# EasyEDA Pro project InForThermometer.eprj

# Schematic Schematic1
Create Date: 2022-08-26; Page Name: P1; Project Name: InForThermometer; Schematic Name: Schematic1; Update Date: 2022-08-30
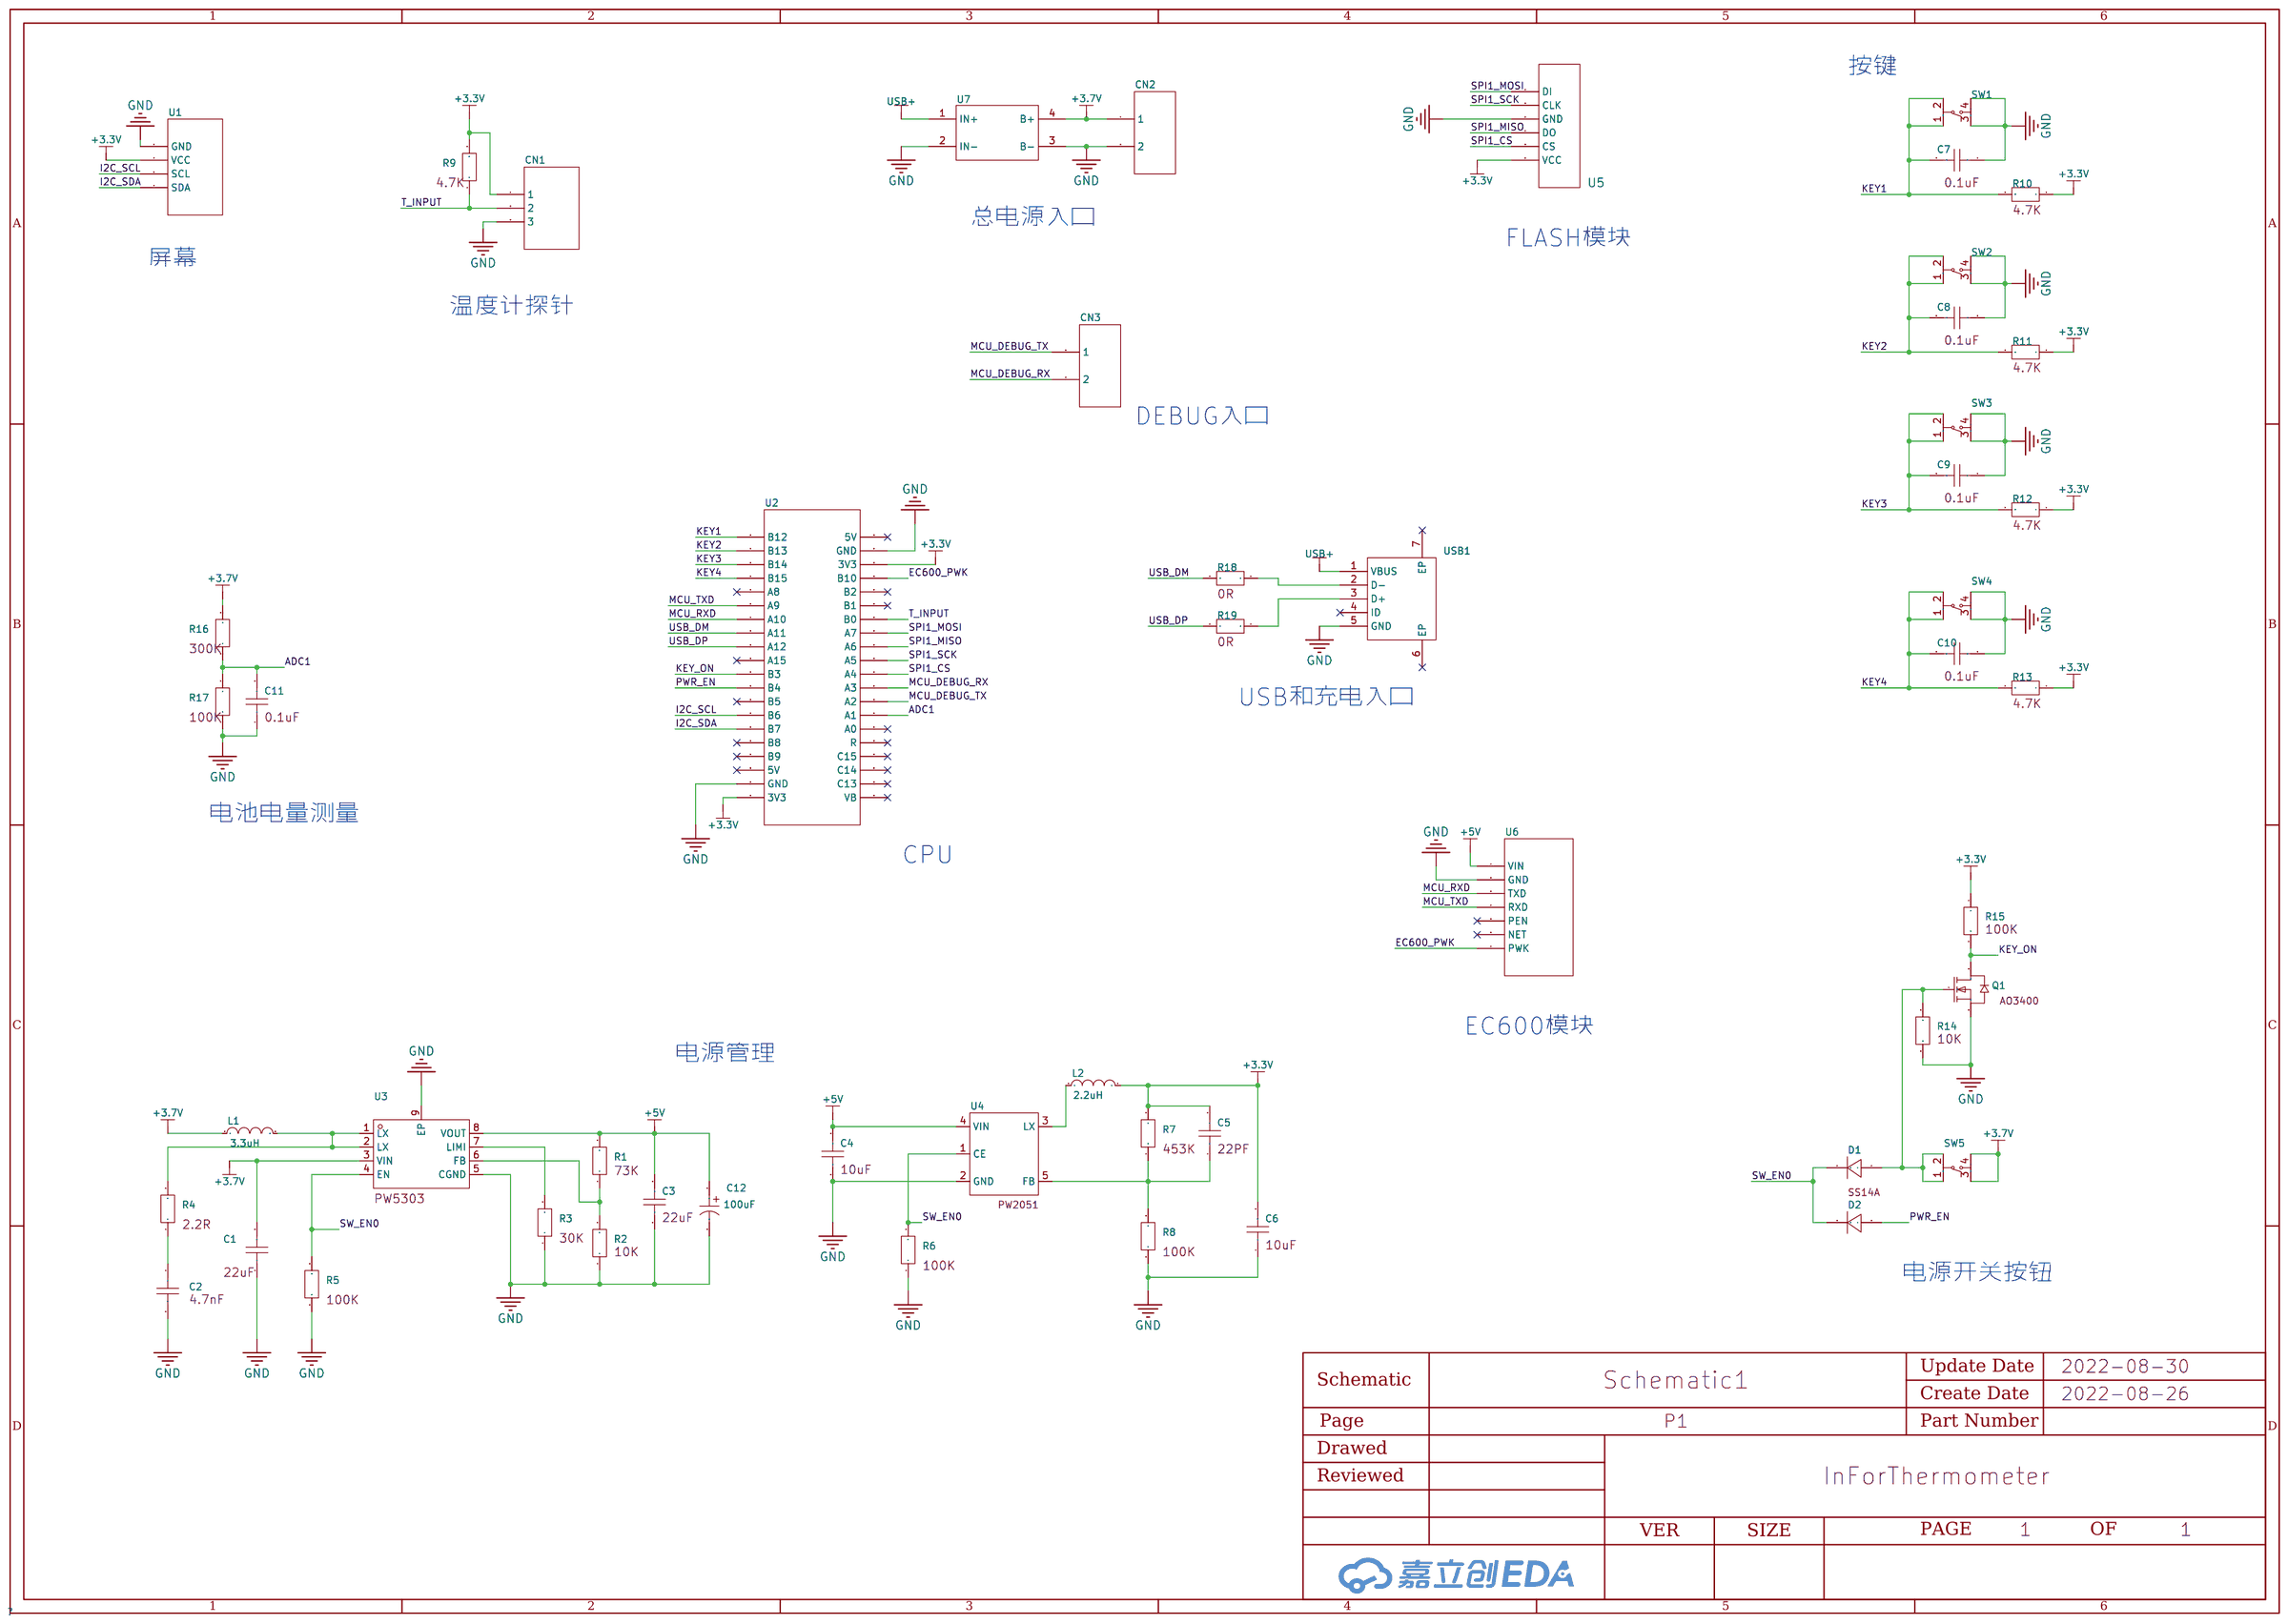
[diagram p0: schematic sheet]

## Parts
C1  -  [0603]
C2  -  [0603]
C3  -  [0603]
C4  -  [0603]
C5  -  [0603]
C6  -  [0603]
C7  -  [0603]
C8  -  [0603]
C9  -  [0603]
C10  -  [0603]
C11  -  [0603]
C12  100uF  [CAP-SMD_BD6.3-L6.6-W6.6-LS7.3-FD]
CN1  -  [XH2.54插件3P]
CN2  -  [XH2.54插件2P]
CN3  -  [XH2.54插件2P]
D1  -  [SMA_L4.3-W2.6-LS5.2-RD]
D2  -  [SMA_L4.3-W2.6-LS5.2-RD]
L1  3.3uH  [IND-SMD_L5.5-W5.0]
L2  2.2uH  [IND-SMD_L4.0-W4.0_0.47UH04209.5A]
Q1  -  [SOT-23-3_L2.9-W1.3-P1.90-LS2.4-BL-2]
R1  -  [0603]
R2  -  [0603]
R3  -  [0603]
R4  -  [0603]
R5  -  [0603]
R6  -  [0603]
R7  -  [0603]
R8  -  [0603]
R9  -  [0603]
R10  -  [0603]
R11  -  [0603]
R12  -  [0603]
R13  -  [0603]
R14  -  [0603]
R15  -  [0603]
R16  -  [0603]
R17  -  [0603]
R18  -  [0603]
R19  -  [0603]
SW1  -  [按钮开关]
SW2  -  [按钮开关]
SW3  -  [按钮开关]
SW4  -  [按钮开关]
SW5  -  [按钮开关]
U1  -  [方形OLED屏幕]
U2  -  [stm32f411模块]
U3  PW5303  [SOP-8_L4.9-W3.9-P1.27-LS6.0-BL-EP-2]
U4  -  [SOT-23-5_L2.9-W1.6-P0.95-LS2.8-BR]
U5  -  [W25Q128FLASH模块]
U6  -  [EC600模块]
U7  -  [TP4056M]
USB1  U-D-M5DD-W-1  [MICRO-USB-TH_MICRO-USB-A14]

## Library data of the parts
C1 C3 = 0603电容: Capacitance: 22uF
C2 = 0603电容: Capacitance: 4.7nF
C4 C6 = 0603电容: Capacitance: 10uF
C5 = 0603电容: Capacitance: 22PF
C7-C11 = 0603电容: Capacitance: 0.1uF
C12 = XT100UF25V90RV0062: 容值:100uF;额定电压:25V;电容体直径:-;电容体长度:-;纹波电流:-;等效串联电阻:-;工作寿命:-;; LCSC Part Name: 100uF 25V; Supplier Part: C2992594; Manufacturer: KNSCHA(科尼盛); Supplier Footprint: SMD,6.3x7.7mm; JLCPCB Part Class: Extended Part; Datasheet: https://atta.szlcsc.com/upload/public/pdf/source/20220414/767750125710ECCCAB7D9F77FC781825.pdf; Supplier: LCSC; Rated Voltage: 25V
CN1 = XH2.54插件3P
CN2 CN3 = XH2.54插件2P
D1 D2 = SS14A: 直流反向耐压(Vr):40V;平均整流电流(Io):1A;正向压降(Vf):500mV@1A;; Supplier: LCSC; Supplier Part: C211770; Supplier Footprint: SMA(DO-214AC); JLCPCB Part Class: Extended Part; LCSC Part Name: 40V 1A 500mV@1A; Datasheet: https://atta.szlcsc.com/upload/public/pdf/source/20180504/C211770_627C435F34E9C107E4A4301F69D28675.pdf; Manufacturer: YANGJIE(扬杰); Average Rectified Current (Io): 1A; Forward Voltage (Vf@If): 500mV@1A; Reverse Voltage (Vr): 40V
L1 = YXMAC0502-3R3M-ANF: 电感值:3.3uH;精度:±20%;额定电流:3A;直流电阻(DCR):76mΩ;; LCSC Part Name: 3.3uH ±20% 3A 76mΩ; Supplier Part: C241344; Manufacturer: 宇鑫科技; Supplier Footprint: SMD; JLCPCB Part Class: Extended Part; Datasheet: https://atta.szlcsc.com/upload/public/pdf/source/20180927/C241344_8E8F720DAEB332122927E4BC9F5CDD37.pdf; Supplier: LCSC; Tolerance: ±20%; Rated Current: 3A; DC Resistance (DCR): 76mΩ
L2 = CMLO0420H2R2MTT: 电感值:2.2uH;精度:±20%;额定电流:3A;直流电阻(DCR):-;; LCSC Part Name: 2.2uH ±20% 3A; Supplier Part: C438930; Manufacturer: Cybermax(思博科技); Supplier Footprint: SMD; JLCPCB Part Class: Extended Part; Supplier: LCSC; Tolerance: ±20%; Rated Current: 3A
Q1 = AO3400: Supplier: LCSC; Supplier Part: C9900013365; Supplier Footprint: SOT23; JLCPCB Part Class: Extended Part; Datasheet: https://atta.szlcsc.comnull
R1 = 电阻: 0603 标准贴片电阻; Resistance: 73K
R2 R14 = 电阻: 0603 标准贴片电阻; Resistance: 10K
R3 = 电阻: 0603 标准贴片电阻; Resistance: 30K
R4 = 电阻: 0603 标准贴片电阻; Resistance: 2.2R
R5 R6 R8 R15 R17 = 电阻: 0603 标准贴片电阻; Resistance: 100K
R7 = 电阻: 0603 标准贴片电阻; Resistance: 453K
R9-R13 = 电阻: 0603 标准贴片电阻; Resistance: 4.7K
R16 = 电阻: 0603 标准贴片电阻; Resistance: 300K
R18 R19 = 电阻: 0603 标准贴片电阻; Resistance: 0R
SW1-SW5 = 按键开关
U1 = 方形OLED屏幕
U2 = stm32f411模块
U3 = PW5303: Supplier Part: C9900000816; Supplier Footprint: ESOP-8EP(4.9x3.9x1.27); JLCPCB Part Class: Extended Part; Datasheet: 2021-10-11/146951A/7b65bb5b4c494c348ec27871fef777b5/PW5303.pdf; Supplier: LCSC
U4 = PW2051: Supplier: LCSC; Supplier Part: C9900004763; Supplier Footprint: SOT23-5; JLCPCB Part Class: Extended Part; Datasheet: 2021-12-24/856123Z/fbe1facec1e64a42b88c21fe7c936e8d/PW2051.pdf
U5 = W25Q128FLASH模块
U6 = EC600模块
U7 = TP4056M
USB1 = U-D-M5DD-W-1: 连接器类型:Micro-B;标准:USB 2.0;公母:母座;触点数量:5;端口数量:1;; LCSC Part Name: Micro-B 母座; Supplier Part: C145795; Manufacturer: 韩国韩荣; Supplier Footprint: 插件; JLCPCB Part Class: Extended Part; Datasheet: https://atta.szlcsc.com/upload/public/pdf/source/20190321/C145795_7870B82BC79666CAD2740B4BEFFA2B3B.pdf; Supplier: LCSC; Connector Type: Micro-B; Standard: USB 2.0; Gender: 母座; Number of Contacts: 5; Number of Ports: 1

## Nets
+3.3V: C5.2 C6.2 CN1.1 L2.2 R7.2 R9.2 R10.1 R11.1 R12.1 R13.1 R15.1 U1.2(VCC) U2.20(3V3) U2.23(3V3) U5.6(VCC)
+3.7V: C1.2 CN2.1 L1.1 R16.2 SW5.3(C) SW5.4(D) U3.3(VIN) U7.4(B+)
+5V: C3.2 C4.2 C12.1 R1.2 U3.8(VOUT) U4.4(VIN) U6.7(VIN)
GND: C1.1 C2.2 C3.1 C4.1 C6.1 C7.1 C8.1 C9.1 C10.1 C11.1 C12.2 CN1.3 CN2.2 Q1.2(S) R2.1 R3.1 R5.1 R6.1 R8.1 R14.2 R17.1 SW1.3(C) SW1.4(D) SW2.3(C) SW2.4(D) SW3.3(C) SW3.4(D) SW4.3(C) SW4.4(D) U1.1(GND) U2.19(GND) U2.22(GND) U3.5(CGND) U3.9(EP) U4.2(GND) U5.3(GND) U6.6(GND) U7.2(IN-) U7.3(B-) USB1.5(GND)
ADC1: C11.2 R16.1 R17.2 U2.34(A1)
EC600_PWK: U2.24(B10) U6.1(PWK)
I2C_SCL: U1.3(SCL) U2.14(B6)
I2C_SDA: U1.4(SDA) U2.15(B7)
KEY1: C7.2 R10.2 SW1.1(A) SW1.2(B) U2.1(B12)
KEY2: C8.2 R11.2 SW2.1(A) SW2.2(B) U2.2(B13)
KEY3: C9.2 R12.2 SW3.1(A) SW3.2(B) U2.3(B14)
KEY4: C10.2 R13.2 SW4.1(A) SW4.2(B) U2.4(B15)
KEY_ON: Q1.3(D) R15.2 U2.11(B3)
MCU_DEBUG_RX: CN3.2 U2.32(A3)
MCU_DEBUG_TX: CN3.1 U2.33(A2)
MCU_RXD: U2.7(A10) U6.5(TXD)
MCU_TXD: U2.6(A9) U6.4(RXD)
PWR_EN: D2.2(A) U2.12(B4)
SPI1_CS: U2.31(A4) U5.5(CS)
SPI1_MISO: U2.29(A6) U5.4(DO)
SPI1_MOSI: U2.28(A7) U5.1(DI)
SPI1_SCK: U2.30(A5) U5.2(CLK)
SW_EN0: D1.1(C) D2.1(C) R5.2 R6.2 U3.4(EN) U4.1(CE)
T_INPUT: CN1.2 R9.1 U2.27(B0)
USB+: U7.1(IN+) USB1.1(VBUS)
USB_DM: R18.2 U2.8(A11)
USB_DP: R19.2 U2.9(A12)
$1N2071: R1.1 R2.2 U3.6(FB)
$1N2222: R3.2 U3.7(LIMI)
$1N2878: L1.2 R4.2 U3.1(LX) U3.2(LX)
$1N3070: C2.1 R4.1
$1N4682: L2.1 U4.3(LX)
$1N4812: C5.1 R7.1 R8.2 U4.5(FB)
$1N14702: D1.2(A) Q1.1(G) R14.1 SW5.1(A) SW5.2(B)
$1N32797: R18.1 USB1.2(D-)
$1N32852: R19.1 USB1.3(D+)

Not connected (* = marked no-connect by the designer): U2 5(A8)* 10(A15)* 13(B5)* 16(B8)* 17(B9)* 18(5V)* 21(5V)* 25(B2)* 26(B1)* 35(A0)* 36(R)* 37(C15)* 38(C14)* 39(C13)* 40(VB)*; U6 2(NET)* 3(PEN)*; USB1 4(ID)* 6(EP)* 7(EP)*

## Notes on the sheet
- 按键
- 总电源入口
- FLASH模块
- 屏幕
- 温度计探针
- DEBUG入口
- USB和充电入口
- 电池电量测量
- CPU
- EC600模块
- 电源管理
- 电源开关按钮

# Board PCB1
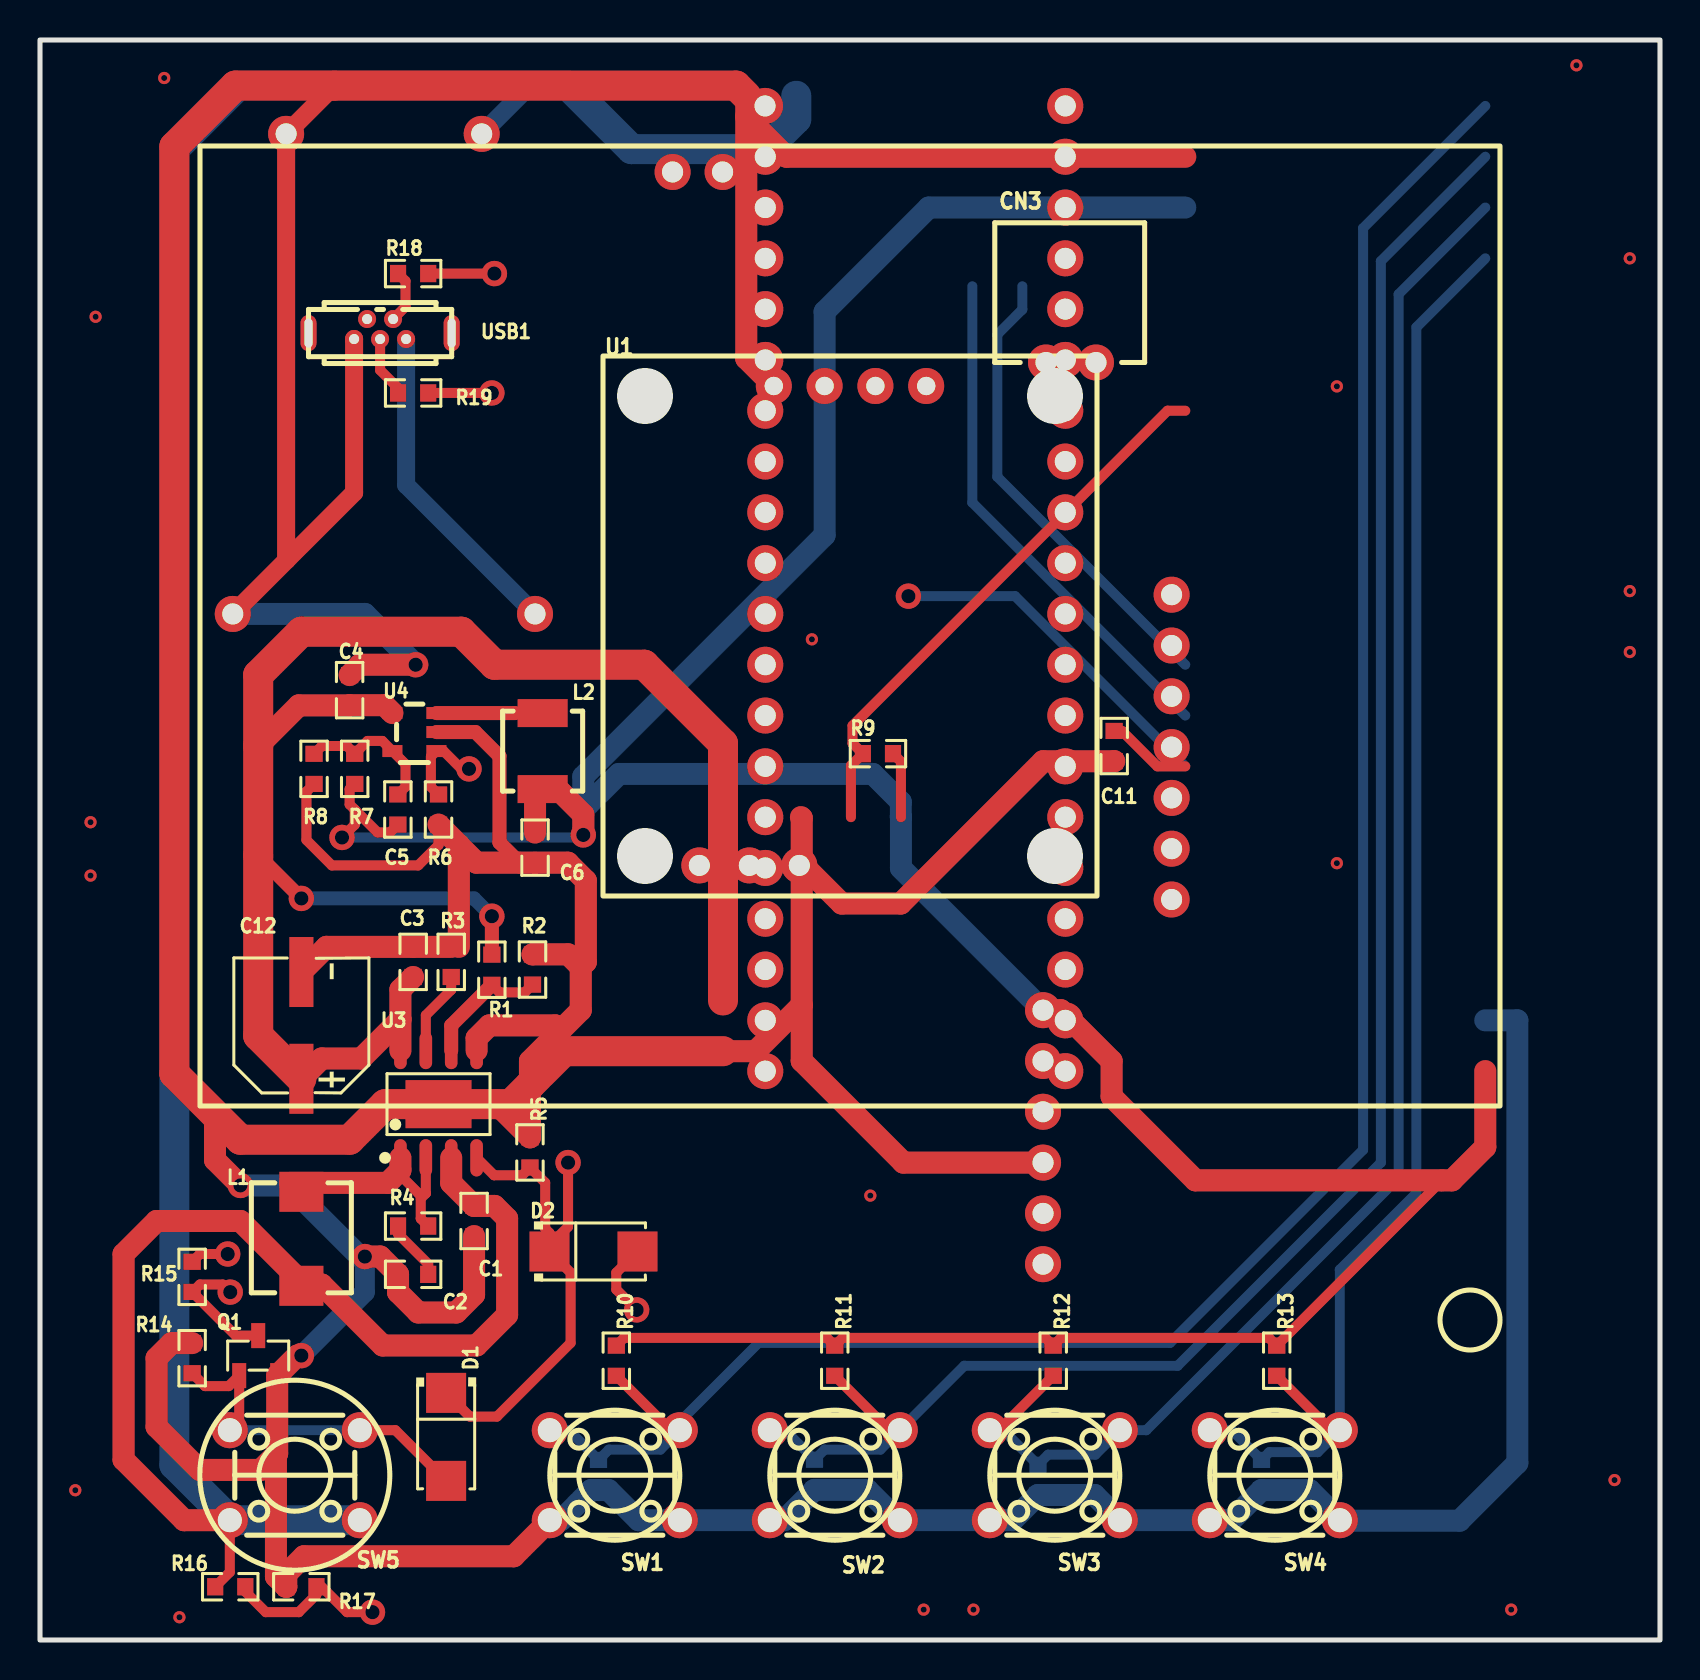
[diagram p1: board, top side]
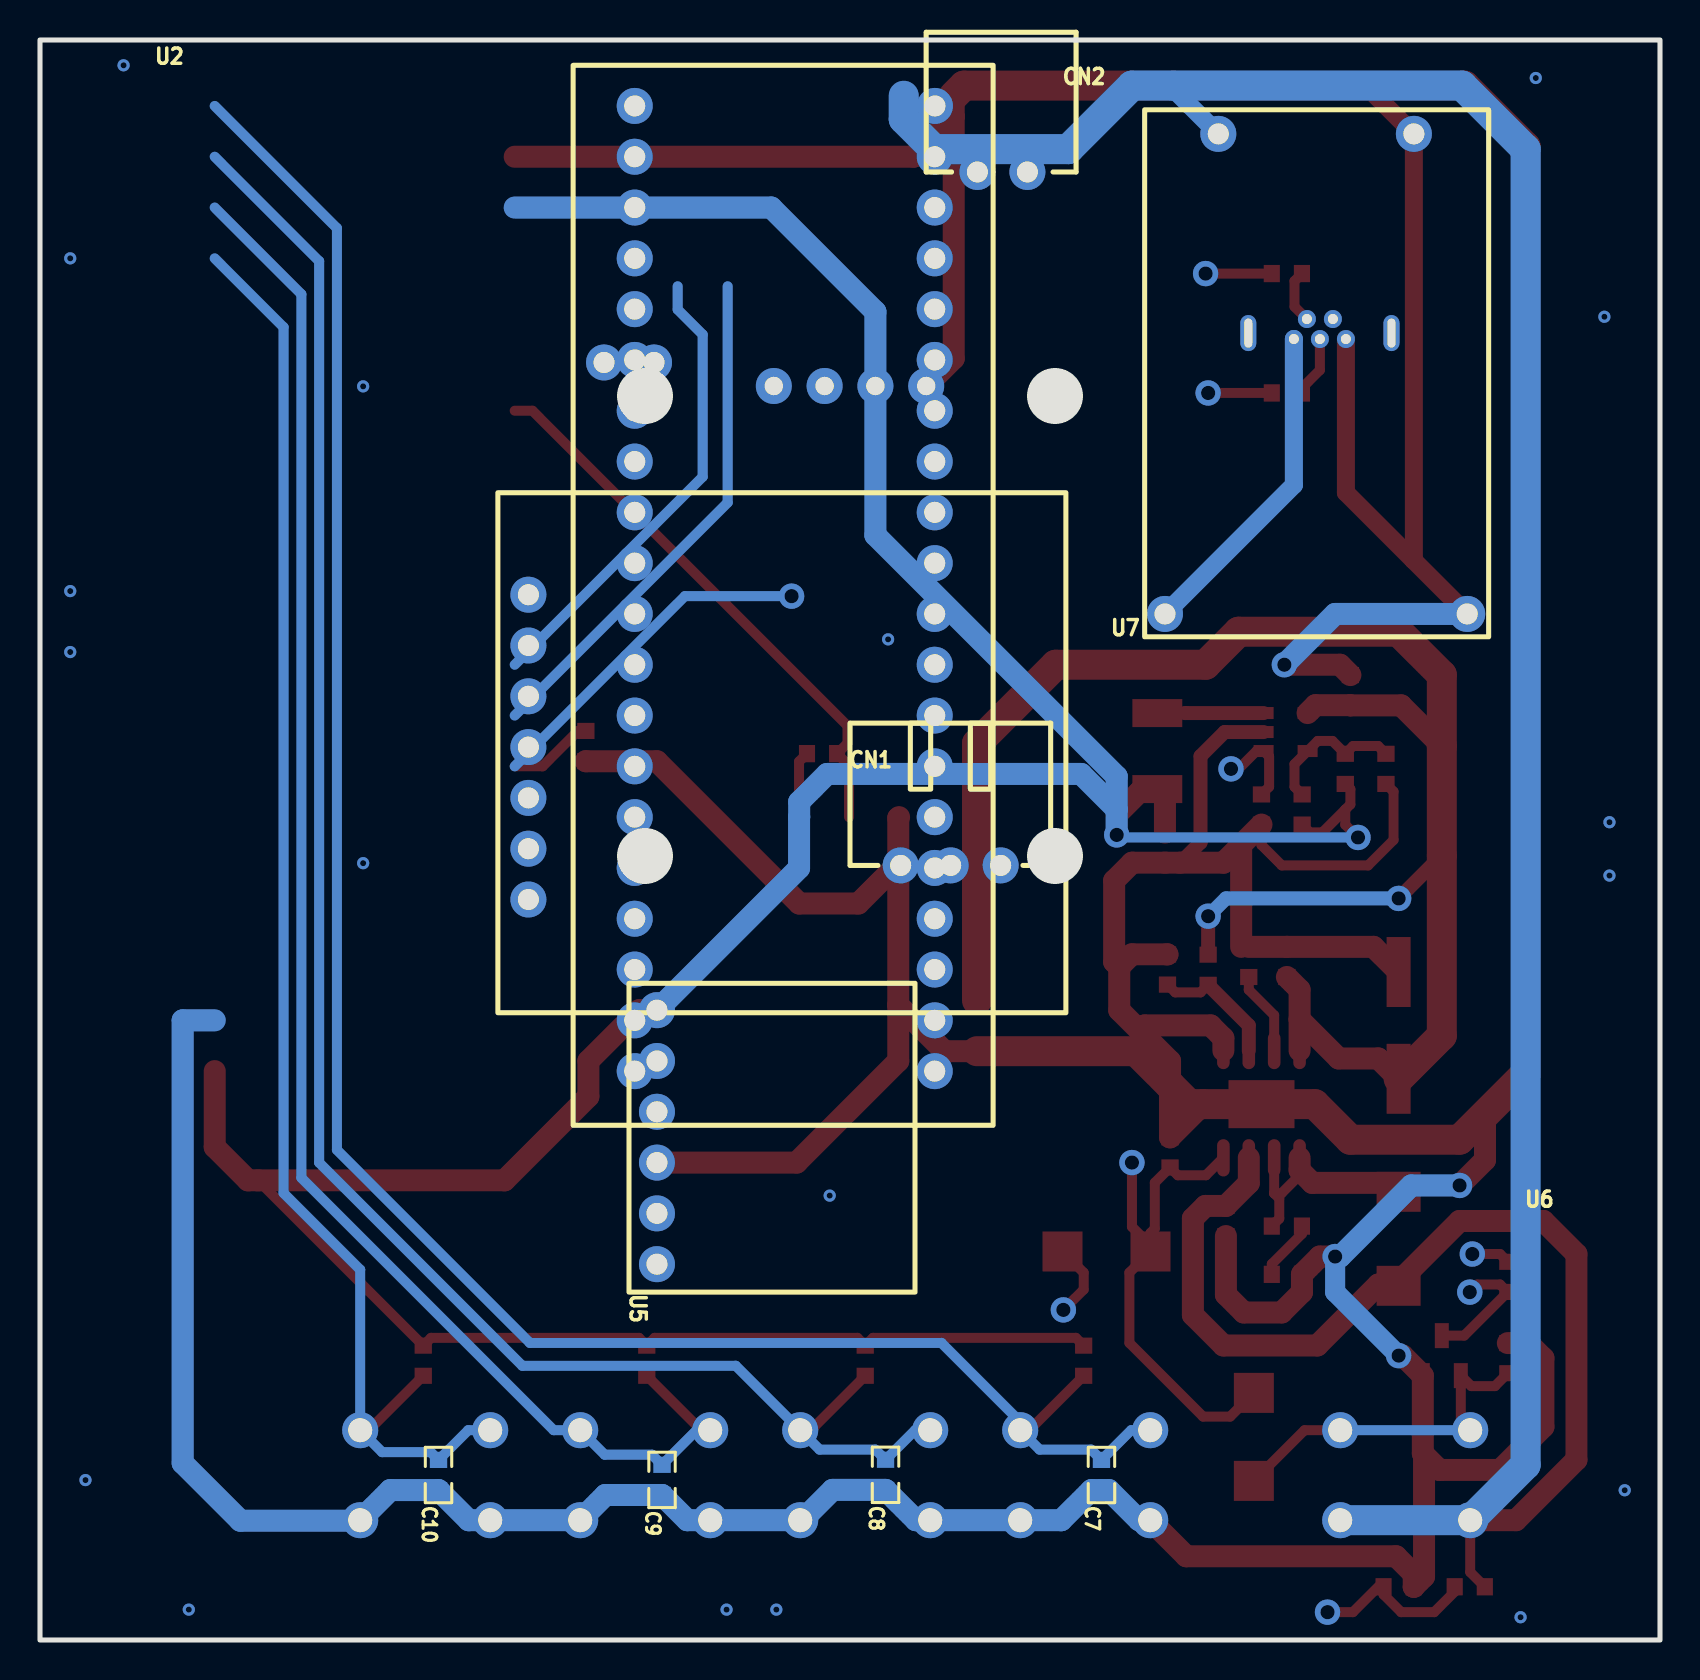
[diagram p2: board, bottom side, seen from below]

Outline 81 x 80 mm; copper layers: Top Layer, CPU1, CPU2, Bottom Layer. Coordinates in mm from the lower left corner of the outline.
Outline path: rectangle 0,80 81,0
Stack: Top Layer 0.035mm / Dielectric1 0.48mm PP er 4.5 / CPU1 0.035mm / Dielectric2 0.48mm FR4 er 4.5 / CPU2 0.035mm / Dielectric3 0.48mm PP er 4.5 / Bottom Layer 0.035mm

## Design rules (mm)
spacing safeClearance (default): track to track 0.152, other pairs 0.152 to 0.3
track width trackWidth (default): min 0.127, default 0.254, max 2.54
differential pair differentialPair (default): width min 0.127, default 0.254, max 2.54; gap min 0.152, default 0.152
via viaSize (default): diameter min 0.5, default 0.61, max 10; hole min 0.3, default 0.305, max 6

## Placement (name value [footprint] x y rotation side)
C1  -  [0603]  21.7 20.95 90 top
C2  -  [0603]  18.66 18.28 180 top
C3  -  [0603]  18.66 33.9 270 top
C4  -  [0603]  15.48 47.49 270 top
C5  -  [0603]  17.89 41.52 270 top
C6  -  [0603]  24.75 39.62 90 top
C7  -  [0603]  27.93 8.25 90 bottom
C8  -  [0603]  38.72 8.26 90 bottom
C9  -  [0603]  49.9 8 90 bottom
C10  -  [0603]  61.07 8.25 90 bottom
C11  -  [0603]  53.71 44.7 90 top
C12  100uF  [CAP-SMD_BD6.3-L6.6-W6.6-LS7.3-FD]  13.07 30.73 90 top
CN1  -  [XH2.54插件3P]  35.55 41.14 0 bottom
CN2  -  [XH2.54插件2P]  32.88 77.21 0 bottom
CN3  -  [XH2.54插件2P]  51.55 67.69 180 top
D1  -  [SMA_L4.3-W2.6-LS5.2-RD]  20.31 10.16 270 top
D2  -  [SMA_L4.3-W2.6-LS5.2-RD]  27.67 19.43 0 top
L1  3.3uH  [IND-SMD_L5.5-W5.0]  13.07 20.06 90 top
L2  2.2uH  [IND-SMD_L4.0-W4.0_0.47UH04209.5A]  25.13 44.44 270 top
Q1  -  [SOT-23-3_L2.9-W1.3-P1.90-LS2.4-BL-2]  10.91 14.22 0 top
R1  -  [0603]  22.59 33.51 90 top
R2  -  [0603]  24.62 33.52 270 top
R3  -  [0603]  20.56 33.9 270 top
R4  -  [0603]  18.66 20.7 0 top
R5  -  [0603]  24.5 24.38 270 top
R6  -  [0603]  19.93 41.52 90 top
R7  -  [0603]  15.73 43.56 270 top
R8  -  [0603]  13.7 43.56 90 top
R9  -  [0603]  41.9 44.32 0 top
R10  -  [0603]  28.82 13.97 270 top
R11  -  [0603]  39.74 13.97 270 top
R12  -  [0603]  50.66 13.97 270 top
R13  -  [0603]  61.84 13.97 270 top
R14  -  [0603]  7.61 14.09 90 top
R15  -  [0603]  7.61 18.16 270 top
R16  -  [0603]  9.51 2.66 180 top
R17  -  [0603]  13.07 2.66 0 top
R18  -  [0603]  18.66 68.32 0 top
R19  -  [0603]  18.66 62.35 0 top
SW1  -  [按钮开关]  28.74 8.24 0 top
SW2  -  [按钮开关]  39.74 8.24 0 top
SW3  -  [按钮开关]  50.74 8.24 0 top
SW4  -  [按钮开关]  61.74 8.24 0 top
SW5  -  [按钮开关]  12.74 8.24 0 top
U1  -  [方形OLED屏幕]  28.15 64.2 0 top
U2  -  [stm32f411模块]  54.34 78.73 180 bottom
U3  PW5303  [SOP-8_L4.9-W3.9-P1.27-LS6.0-BL-EP-2]  19.93 26.79 0 top
U4  -  [SOT-23-5_L2.9-W1.6-P0.95-LS2.8-BR]  18.72 45.4 0 top
U5  -  [W25Q128FLASH模块]  51.55 17.39 90 bottom
U6  -  [EC600模块]  35.67 37.08 90 bottom
U7  -  [TP4056M]  25.77 50.16 90 bottom
USB1  U-D-M5DD-W-1  [MICRO-USB-TH_MICRO-USB-A14]  17 65.55 180 top

## Footprints (pads in the part's own frame, mm; a bottom-side part is the same pattern mirrored in y, then rotated)
0603
  rect 0.806x0.864 smd: 1(-0.753,0) 2(0.753,0)
CAP-SMD_BD6.3-L6.6-W6.6-LS7.3-FD
  rect 3.5x1.2 smd: 1(-2.67,0) 2(2.67,0)
EC600模块
  round 1.8 hole 1.05: 1(-0.054,20.907) 2(2.486,20.907) 3(5.026,20.907) 4(7.566,20.907) 5(10.106,20.907) 6(12.646,20.907) 7(15.186,20.907)
IND-SMD_L4.0-W4.0_0.47UH04209.5A
  rect 1.399x2.499 smd: 1(-1.9,0) 2(1.9,0)
IND-SMD_L5.5-W5.0
  rect 1.999x2.2 smd: 1(-2.349,0) 2(2.349,0)
MICRO-USB-TH_MICRO-USB-A14
  round 0.899 hole 0.5: 1(-1.3,0.5) 2(-0.65,-0.5) 3(0,0.5) 4(0.65,-0.5) 5(1.3,0.5)
  oval 0.8x1.801 hole 0.399x1.45: 6(-3.579,0.201) 7(3.579,0.201)
SMA_L4.3-W2.6-LS5.2-RD
  rect 2x2 smd: 1(-2.2,0) 2(2.2,0)
SOP-8_L4.9-W3.9-P1.27-LS6.0-BL-EP-2
  oval 0.63x1.865 smd: 1(-1.905,-2.683) 2(-0.635,-2.683) 3(0.635,-2.683) 4(1.905,-2.683) 5(1.905,2.683) 6(0.635,2.683) 7(-0.635,2.683) 8(-1.905,2.683)
  rect 3.3x2.4 smd: 9(0,0)
SOT-23-3_L2.9-W1.3-P1.90-LS2.4-BL-2
  rect 0.7x1.25 smd: 1(-0.95,-1) 2(0.95,-1) 3(0,1)
SOT-23-5_L2.9-W1.6-P0.95-LS2.8-BR
  rect 1.001x0.6 smd: 1(1.1,-0.95) 2(1.1,0) 3(1.1,0.95) 4(-1.1,0.95) 5(-1.1,-0.95)
stm32f411模块
  round 1.8 hole 1.05: 1(3.079,-2.032) 2(3.079,-4.572) 3(3.079,-7.112) 4(3.079,-9.652) 5(3.079,-12.192) 6(3.079,-14.732) 7(3.079,-17.272) 8(3.079,-19.812) 9(3.079,-22.352) 10(3.079,-24.892) 11(3.079,-27.432) 12(3.079,-29.972) 13(3.079,-32.512) 14(3.079,-35.052) 15(3.079,-37.592) 16(3.079,-40.132) 17(3.079,-42.672) 18(3.079,-45.212) 19(3.079,-47.752) 20(3.079,-50.292) 21(18.09,-2.032) 22(18.079,-4.572) 23(18.079,-7.112) 24(18.079,-9.652) 25(18.079,-12.192) 26(18.079,-14.732) 27(18.079,-17.272) 28(18.079,-19.812) 29(18.079,-22.352) 30(18.079,-24.892) 31(18.079,-27.432) 32(18.079,-29.972) 33(18.079,-32.512) 34(18.079,-35.052) 35(18.079,-37.592) 36(18.079,-40.132) 37(18.079,-42.672) 38(18.079,-45.212) 39(18.079,-47.752) 40(18.079,-50.292)
TP4056M
  round 1.8 hole 1.05: 1(1.143,-1.016) 2(1.143,-16.129) 3(25.146,-13.462) 4(25.146,-3.683)
W25Q128FLASH模块
  round 1.8 hole 1.05: 1(1.397,-1.397) 2(3.937,-1.397) 3(6.477,-1.397) 4(9.017,-1.397) 5(11.557,-1.397) 6(14.097,-1.397)
XH2.54插件2P
  round 1.8 hole 1.05: 1(1.25,3.81) 2(-1.25,3.81)
XH2.54插件3P
  round 1.8 hole 1.05: 1(2.42,2.413) 2(-0.08,2.413) 3(-2.58,2.413)
按钮开关
  round 1.8 hole 1.2: 1(-3.25,2.25) 2(3.25,2.25) 3(-3.25,-2.25) 4(3.25,-2.25)
方形OLED屏幕
  round 1.8 hole 0.914: 1(8.54,-1.5) 2(11.08,-1.5) 3(13.62,-1.5) 4(16.16,-1.5)

## Nets
As in the schematic.

Pads without a net: U2 5 10 13 16 17 18 21 25 26 35 36 37 38 39 40; U6 2 3; USB1 4 6 7

## Via types
v1: diameter 0.61, hole 0.305, Top Layer to Bottom Layer, 18 vias
v2: diameter 1.27, hole 0.711, Top Layer to Bottom Layer, 17 vias

## Routing (per net, layer and track width the routed paths; a pad name or vN(x,y) marks a point on that pad's centre or on a via; arc(x,y) is an arc through that point)
+3.3V: length 222.8
  Top Layer w0.5: 43.05,41.14 43.05,43.92 R9.2 ; v2(15.1,40.13) 15.73,40.76 15.73,41.52 ; C5.2 17.5,40.38 16.88,40.38 15.73,41.52 ; R10.1 29.21,15.11 39.35,15.11 R11.1 40.13,15.11 50.27,15.11 R12.1 51.05,15.11 61.45,15.11 R13.1 70.1,22.98 ; 15.73,41.52 15.48,41.78 15.48,42.55 R7.2 ; R15.1 8,19.3 v2(9.39,19.3)
  Top Layer w1.1: v2(27.16,40.25) 27.16,41.27 26.02,42.41 24.5,42.41 ; 72.26,28.44 72.26,24.65 70.6,22.98 57.77,22.98 53.58,27.17 53.58,28.95 51.04,31.49 U5.6 ; C6.2 24.75,42.16
  CPU2 w0.5: v2(27.16,40.25) 18.28,40.25 7.61,29.59 7.61,21.08 v2(9.39,19.3)
  Bottom Layer w0.5: 27.04,40.13 v2(15.1,40.13)
  Bottom Layer w1.1: U5.6 43.05,38.6 43.05,41.14 43.04,41.15 43.04,41.91 41.64,43.3 28.94,43.3 27.16,41.52 ; 27.16,41.52 27.16,43.17 39.23,55.24 U1.2 39.23,66.42 44.44,71.62 57.26,71.62 ; 27.16,41.52 v2(27.16,40.25)
+3.7V: length 168.2
  Top Layer w0.5: SW5.3 9.49,3.39 R16.2
  Top Layer w1.1: U3.3 20.56,22.85 C1.2 22.73,21.7 23.35,21.08 23.35,16.25 21.83,14.73 17.13,14.73 14.08,17.78 13.19,17.78 10.02,20.95 5.83,20.95 4.18,19.3 4.18,9.01 7.2,5.99 SW5.3
  Bottom Layer w0.9: 24.32,77.72 24.32,77.54 U7.4
  Bottom Layer w1.5: SW5.4 SW5.3 6.72,8.76 6.72,74.54 9.89,77.72 26.4,77.72 29.58,74.54 36.31,74.54 37.81,76.05 37.81,77.21
+5V: length 93.1
  Top Layer w0.7: v2(13.07,37.08) 10.93,39.22 10.91,39.22 ; R1.2 v2(22.59,36.19)
  Top Layer w1.1: C3.2 18.02,32.52 18.02,31.03 ; 18.02,31.03 16.07,29.08 14.09,29.08 C12.1 ; 18.02,31.03 U3.8 ; U4.4 17.23,46.74 C4.2 15.47,46.73 12.94,46.73 10.91,44.7
  Top Layer w1.5: 34.15,31.98 34.15,44.83 30.21,48.76 22.72,48.76 21.07,50.41 13.07,50.41 10.91,48.25 10.91,30.22 C12.1
  Bottom Layer w0.7: v2(13.07,37.08) 21.7,37.08 v2(22.59,36.19)
GND: length 463.6
  Top Layer w0.5: R8.1 13.32,42.42 13.32,40 14.59,38.73 18.91,38.73 19.93,39.75 R6.1
  Top Layer w0.7: 23.98,38.87 22.97,39.87 22.97,44.19 21.77,45.4 U4.2
  Top Layer w0.9: 14.72,77.72 U7.3 12.31,54.01 12.32,53.99 ; 12.32,53.99 15.7,57.37 USB1.5 ; 12.32,53.99 U7.2
  Top Layer w1.1: C4.1 16,48.76 v2(18.78,48.76) ; R6.1 20.94,39.75 20.94,39.75 ; 35.31,76.17 35.31,77.21 ; 35.31,76.17 35.31,64.08 U1.1 ; 35.31,76.17 37.32,74.16 57.26,74.16 ; 38.09,31.75 38.09,38.82 ; 38.09,31.75 38.09,28.95 43.17,23.87 U5.3 ; 38.09,31.75 35.78,29.44 34.15,29.44 ; 38.09,38.82 38.09,41.1 38.05,41.14 ; 38.09,38.82 40.08,36.83 43.04,36.83 50.15,43.94 53.7,43.94 C11.1 ; SW1.3 23.69,4.19 13.19,4.19 12.31,3.31 R17.1 12.31,2.66 11.8,3.17 11.8,9.27 ; C12.2 14.33,34.66 C3.1 R3.1 ; 26.02,30.47 25.77,30.73 22.47,30.73 21.83,30.09 U3.5 ; 26.02,30.47 24.5,28.95 R5.1 22.84,26.79 ; 26.02,30.47 27.04,31.49 27.04,33.65 ; 25.09,28.15 24.9,28.15 ; R2.1 24.63,34.28 26.4,34.28 27.04,33.65 ; C1.1 21.7,17.27 20.81,16.38 18.91,16.38 17.9,17.39 C2.2 17.01,19.17 v2(16.24,19.17) ; 20.94,39.75 20.94,34.66 ; 20.94,39.75 21.82,38.87 C6.1 26.39,38.87 27.29,37.97 27.29,33.9 27.04,33.65 ; v2(10.02,22.73) 8.75,24 8.75,26.28 ; 11.8,9.27 11.04,8.5 7.99,8.5 5.83,10.66 5.83,14.09 6.58,14.85 R14.2 ; 11.8,9.27 11.86,9.33 Q1.2 12.86,14.22 v2(13.07,14.22) ; 26.2,29.44 26.2,29.25
  Top Layer w1.5: 34.15,29.44 26.2,29.44 ; 24.9,28.15 23.55,26.79 U3.9 17.26,26.79 15.48,25.01 10.02,25.01 6.72,28.32 6.72,74.67 9.77,77.72 34.81,77.72 35.31,77.21 ; 26.01,29.25 25.09,28.33
  Bottom Layer w1: v2(16.24,19.17) 16.24,17.39 v2(13.07,14.22)
  Bottom Layer w1.1: v2(10.02,22.73) 12.43,22.73 15.99,19.17 v2(16.24,19.17) ; 72.26,30.98 73.87,30.98 73.87,8.85 70.98,5.96 65.02,5.96 SW4.4 63.48,7.5 C10.1 59.57,5.99 SW4.3 SW3.4 52.73,7.25 C9.1 48.64,5.99 SW3.3 SW2.4 42.96,5.96 42.91,5.96 41.37,7.51 38.72,7.51 37.21,5.99 SW1.4 29.93,5.99 28.43,7.5 C7.1 27.55,7.5 26.05,5.99 SW1.3 ; v2(18.78,48.76) 16.24,51.3 U7.2
  vias: v1(1.77,7.49) v1(2.53,40.89) v1(2.53,38.22) v1(2.78,66.16) v1(6.21,78.1) v1(6.97,1.14) v1(38.59,50.03) v1(41.52,22.22) v1(44.18,1.52) v1(46.67,1.52) v1(64.84,62.68) v1(64.84,38.84) v1(73.56,1.52) v1(76.82,78.73) v1(78.73,8) v1(79.49,69.08) v1(79.49,52.45) v1(79.49,49.4)
ADC1: length 129.9
  Top Layer w0.5: 57.26,43.68 55.87,43.68 54.1,45.45 C11.2 ; v2(16.62,1.39) 15.35,1.39 13.95,2.79 R17.2 13.82,2.27 12.94,1.39 11.29,1.39 10.27,2.42 R16.1
  CPU2 w0.5: v2(16.62,1.39) 10.4,1.39 4.56,7.23 4.56,50.29 9.64,55.37 40.25,55.37 v2(43.42,52.19)
  Bottom Layer w0.5: v2(43.42,52.19) 48.75,52.19 57.26,43.68
EC600_PWK: length 64.3
  CPU1 w0.5: 34.15,16.74 31.23,19.66 31.23,32.76 34.78,36.32 34.78,41.02 54.72,60.95 54.72,66.54 57.26,69.08
I2C_SCL: length 72.4
  CPU1 w0.4: U1.3 41.77,72.89 47.1,78.23 63.61,78.23 67.3,74.54 67.3,48.65 72.26,43.68
I2C_SDA: length 73.9
  CPU2 w0.4: 72.26,41.14 67.3,46.11 67.3,74.54 63.61,78.23 47.1,78.23 44.31,75.43 U1.4
KEY1: length 107
  Top Layer w0.5: SW1.2 31.54,10.49 R10.2
  Bottom Layer w0.5: SW1.1 26.44,10.49 C7.2 28.44,9.52 31.02,9.52 SW1.2 31.99,10.92 35.93,14.85 56.5,14.85 66.15,24.51 66.15,70.59 72.26,76.7
KEY2: length 94.2
  Top Layer w0.5: SW2.2 42.46,10.49 R11.2
  Bottom Layer w0.5: SW2.1 37.24,10.49 C8.2 39.23,9.52 42.02,9.52 SW2.2 46.21,13.71 56.88,13.71 67.04,23.87 67.04,68.94 72.26,74.16
KEY3: length 81.7
  Top Layer w0.5: SW3.1 47.94,10.49 R12.2
  Bottom Layer w0.5: 72.26,71.62 67.93,67.29 67.93,23.11 55.31,10.49 SW3.2 52.77,9.27 50.41,9.27 C9.2 48.17,10.49 SW3.1
KEY4: length 73.6
  Top Layer w0.5: R13.2 64.56,10.49 SW4.2
  Bottom Layer w0.5: SW4.1 59.59,10.49 C10.2 61.46,9.39 63.89,9.39 SW4.2 64.99,18.52 68.82,22.35 68.82,65.64 72.26,69.08
KEY_ON: length 107.3
  Top Layer w0.5: 7.62,17.39 9.79,15.22 Q1.3 ; 7.62,17.39 8,17.78 9.13,17.78 v2(9.51,17.39) ; 7.62,17.39 R15.2
  CPU2 w0.5: v2(9.51,17.39) 13.19,17.39 17.51,13.08 62.72,13.08 76.69,27.05 76.69,46.87 72.26,51.3
MCU_DEBUG_RX: length 23.3
  Bottom Layer w0.5: 57.26,48.76 47.87,58.16 47.87,65.27 49.12,66.52 49.12,67.69
MCU_DEBUG_TX: length 25.9
  Bottom Layer w0.5: 46.62,67.69 46.62,56.87 57.26,46.22
MCU_RXD: length 86.1
  CPU1 w0.5: 72.26,61.46 73.65,61.46 75.17,59.94 75.17,27.43 64,16.25 44.82,16.25 34.17,26.9 34.15,26.9
MCU_TXD: length 90.1
  CPU1 w0.5: 34.15,24.36 43.28,15.24 64.5,15.24 76.06,26.79 76.06,61.59 73.65,64 72.26,64
PWR_EN: length 78.5
  Top Layer w0.5: D2.2 28.82,18.37 28.82,17.52 v2(29.83,16.5)
  CPU2 w0.5: 72.26,48.76 75.43,45.6 75.43,27.55 61.96,14.09 32.25,14.09 v2(29.83,16.5)
SPI1_CS: length 27.8
  CPU1 w0.5: 57.26,51.3 47.1,41.14 47.1,32 U5.5
SPI1_MISO: length 36.8
  CPU1 w0.5: U5.4 49.14,26.41 46.22,29.33 46.22,45.33 57.26,56.38
SPI1_MOSI: length 48.2
  CPU1 w0.5: U5.1 48.37,18.79 45.2,21.97 45.2,46.86 57.26,58.92
SPI1_SCK: length 39.3
  CPU2 w0.5: 57.26,53.84 45.83,42.41 45.83,25.14 49.64,21.33 50.15,21.33
SW_EN0: length 51.7
  Top Layer w0.5: 25.47,19.73 26.4,20.66 v2(26.4,23.87) ; 25.47,19.73 25.47,20.36 25.26,20.57 25.26,22.86 R5.2 24.11,23.24 22.7,23.24 U3.4 ; 25.47,19.73 D2.1 26.53,18.37 26.53,14.85 22.85,11.17 21.49,11.17 D1.1 ; v2(21.45,43.56) 21.07,43.56 20.18,44.45 U4.1 19.54,44.17 19.54,42.66 R6.2
  CPU1 w0.5: v2(21.45,43.56) 25.39,39.62 25.39,24.89 v2(26.4,23.87)
T_INPUT: length 28.2
  Top Layer w0.5: 40.55,41.14 40.55,43.72 R9.1 40.63,44.83 40.63,45.72 56.38,61.46 57.26,61.46
USB+: length 16.4
  Bottom Layer w0.9: U7.1 18.31,57.75 USB1.1
USB_DM: length 73.5
  Top Layer w0.5: R18.2 v2(22.72,68.32)
  CPU1 w0.4: v2(22.72,68.32) 33.26,68.32 44.18,79.24 65.14,79.24 68.19,76.19 68.19,63 72.26,58.92
USB_DP: length 78.5
  Top Layer w0.5: R19.2 v2(22.59,62.35)
  CPU2 w0.4: v2(22.59,62.35) 28.56,68.32 33.39,68.32 33.39,68.45 44.18,79.24 65.01,79.24 68.19,76.07 68.19,60.46 72.26,56.38
$1N2071: length 6.5
  Top Layer w0.5: R2.2 24.24,32.38 22.97,32.38 R1.1
  Top Layer w0.7: R1.1 20.56,30.73 U3.6
$1N2222: length 4.2
  Top Layer w0.5: U3.7 19.29,31.24 20.56,32.51 R3.2
$1N2878: length 11.7
  Top Layer w0.5: 19.29,22.33 18.93,22.33 18.02,23.24 ; 19.29,22.33 19.04,22.08 19.04,21.07 R4.2 ; 19.29,22.33 U3.2
  Top Layer w1.1: 12.5,22.86 17.39,22.86 18.02,23.49 U3.1
$1N3070: length 3
  Top Layer w0.5: R4.1 17.9,20.31 19.41,18.8 C2.1
$1N4682: length 3.9
  Top Layer w0.7: U4.3 23.73,46.35 23.74,46.34
$1N4812: length 7.3
  Top Layer w0.5: R8.2 14.09,44.7 15.35,44.7 R7.1 16.38,44.95 17.11,44.95 U4.5 18.28,43.79 18.28,42.66 C5.1
$1N14702: length 17.6
  Top Layer w0.5: SW5.2 17.77,10.49 D1.2 ; SW5.1 9.96,10.96 Q1.1 9.44,12.69 8.25,12.69 R14.1
  Bottom Layer w0.5: SW5.1 SW5.2
$1N32797: length 2.7
  Top Layer w0.5: USB1.2 18.28,66.67 18.28,67.95 R18.1
$1N32852: length 3.1
  Top Layer w0.5: R19.1 17.9,62.6 17,63.5 USB1.3

## Copper pours and planes (outline as drawn; the poured copper is in the pictures)
GND on Top Layer: -105.92,82.29 -24.92,82.29 -24.92,2.29 -105.92,2.29
GND on Bottom Layer: -103.63,7.48 -22.63,7.48 -22.63,-72.52 -103.63,-72.52
